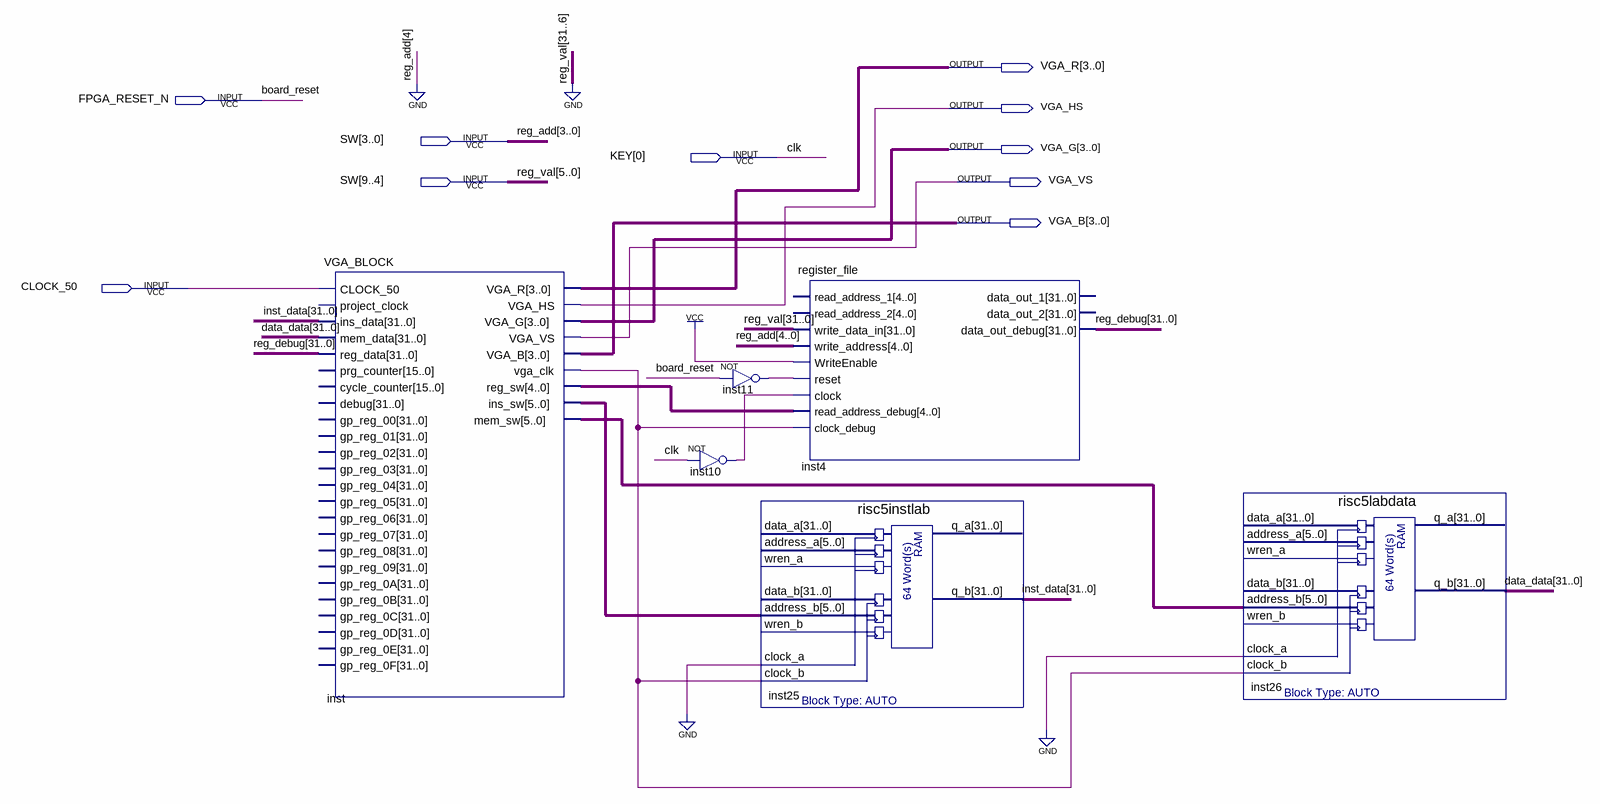
[diagram p0: schematic sheet]
// Quartus schematic top.bdf as structural Verilog: 6 symbols, 10 pins
module top (
  input  FPGA_RESET_N,
  input  [9:0] SW,
  input  [0:0] KEY,
  input  CLOCK_50,
  output [3:0] VGA_R,
  output VGA_HS,
  output [3:0] VGA_G,
  output VGA_VS,
  output [3:0] VGA_B
);

  wire inst10_out, inst11_out, inst_vga_clk;
  wire [4:0] inst_reg_sw;
  wire [5:0] inst_ins_sw, inst_mem_sw;
  wire [31:0] data_data, inst_data, reg_debug;

  VGA_BLOCK inst (
    .CLOCK_50(CLOCK_50), .ins_data(inst_data), .mem_data(data_data), .reg_data(reg_debug), .VGA_R(VGA_R),
    .VGA_HS(VGA_HS), .VGA_G(VGA_G), .VGA_VS(VGA_VS), .VGA_B(VGA_B), .vga_clk(inst_vga_clk),
    .reg_sw(inst_reg_sw), .ins_sw(inst_ins_sw), .mem_sw(inst_mem_sw));  // open: project_clock, prg_counter, cycle_counter, debug, gp_reg_00, gp_reg_01, gp_reg_02, gp_reg_03, gp_reg_04, gp_reg_05, gp_reg_06, gp_reg_07, gp_reg_08, gp_reg_09, gp_reg_0A, gp_reg_0B, gp_reg_0C, gp_reg_0D, gp_reg_0E, gp_reg_0F
  not inst10 (inst10_out, KEY[0]);
  not inst11 (inst11_out, FPGA_RESET_N);
  risc5instlab inst25 (
    .address_b(inst_ins_sw), .clock_a(1'b0), .clock_b(inst_vga_clk), .q_b(inst_data));  // open: data_a, address_a, wren_a, data_b, wren_b, q_a
  register_file inst4 (
    .write_data_in({{26{1'b0}}, SW[9:4]}), .write_address({1'b0, SW[3:0]}), .WriteEnable(1'b1),
    .reset(inst11_out), .clock(inst10_out), .read_address_debug(inst_reg_sw), .clock_debug(inst_vga_clk),
    .data_out_debug(reg_debug));  // open: read_address_1, read_address_2, data_out_1, data_out_2
  risc5labdata inst26 (
    .address_b(inst_mem_sw), .clock_a(1'b0), .clock_b(inst_vga_clk), .q_b(data_data));  // open: data_a, address_a, wren_a, data_b, wren_b, q_a

  // Other names for the same wires on the sheet: board_reset = FPGA_RESET_N; clk = KEY[0]; reg_add[3:0] = SW[3:0];
  //   reg_val[5:0] = SW[9:4]
endmodule
